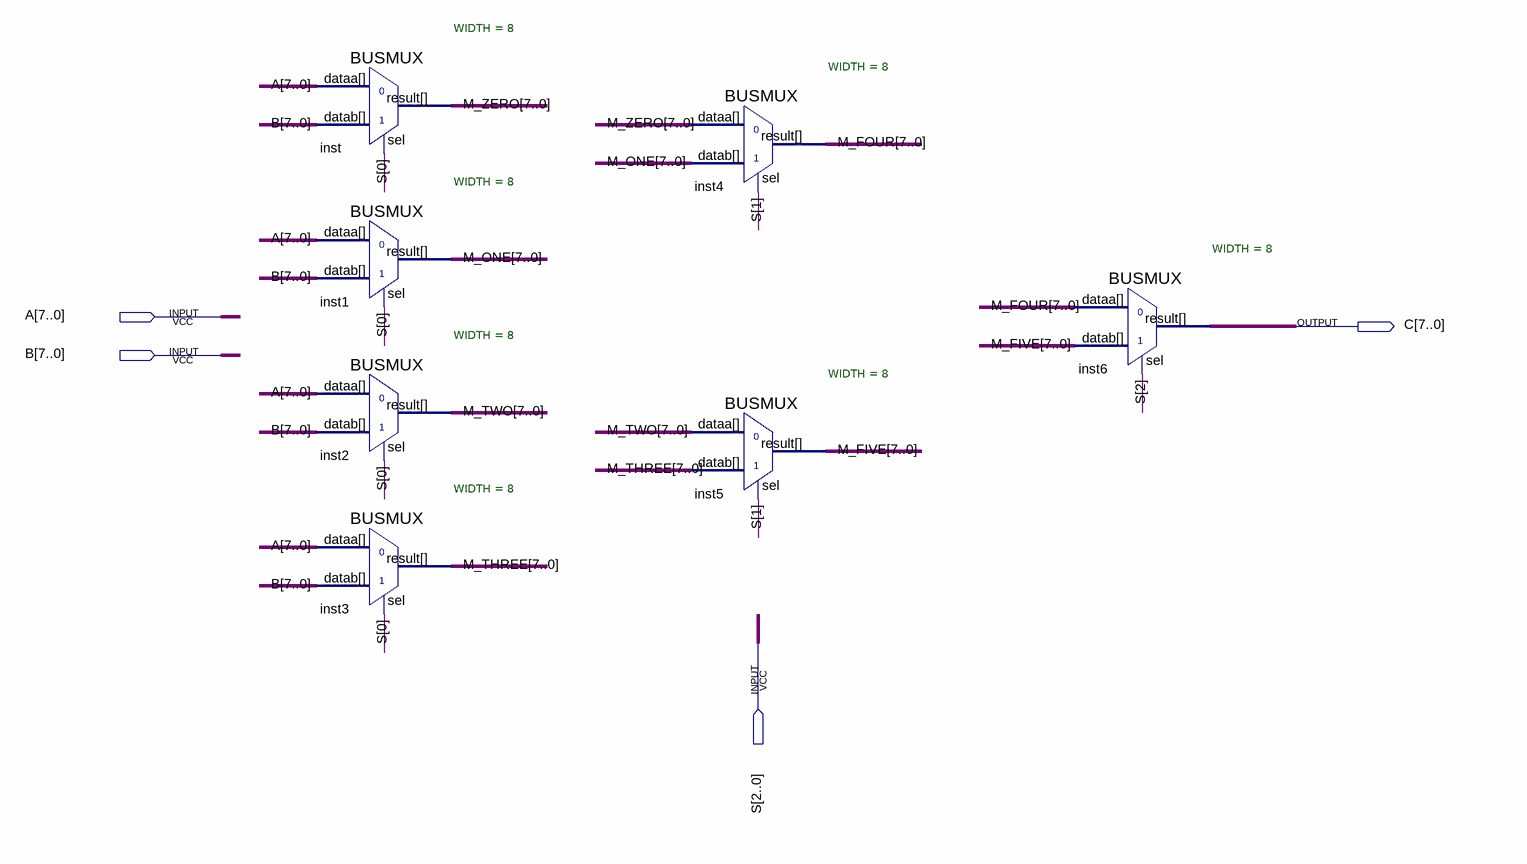
[diagram p0: schematic sheet]
// Quartus schematic 8-to-1-mux.bdf as structural Verilog: 7 symbols, 4 pins
module \8-to-1-mux  (
  input  [7:0] A,
  input  [7:0] B,
  input  [2:0] S,
  output [7:0] C
);

  wire [7:0] M_FIVE, M_FOUR, M_ONE, M_THREE, M_TWO, M_ZERO;

  BUSMUX #(.WIDTH(8)) inst (.datab(B), .sel(S[0]), .dataa(A), .result(M_ZERO));
  BUSMUX #(.WIDTH(8)) inst1 (.datab(B), .sel(S[0]), .dataa(A), .result(M_ONE));
  BUSMUX #(.WIDTH(8)) inst2 (.datab(B), .sel(S[0]), .dataa(A), .result(M_TWO));
  BUSMUX #(.WIDTH(8)) inst3 (.datab(B), .sel(S[0]), .dataa(A), .result(M_THREE));
  BUSMUX #(.WIDTH(8)) inst4 (.datab(M_ONE), .sel(S[1]), .dataa(M_ZERO), .result(M_FOUR));
  BUSMUX #(.WIDTH(8)) inst5 (.datab(M_THREE), .sel(S[1]), .dataa(M_TWO), .result(M_FIVE));
  BUSMUX #(.WIDTH(8)) inst6 (.datab(M_FIVE), .sel(S[2]), .dataa(M_FOUR), .result(C));
endmodule
